# EAGLE schematic Breadboard Breakout Module (EAGLE 6.3)
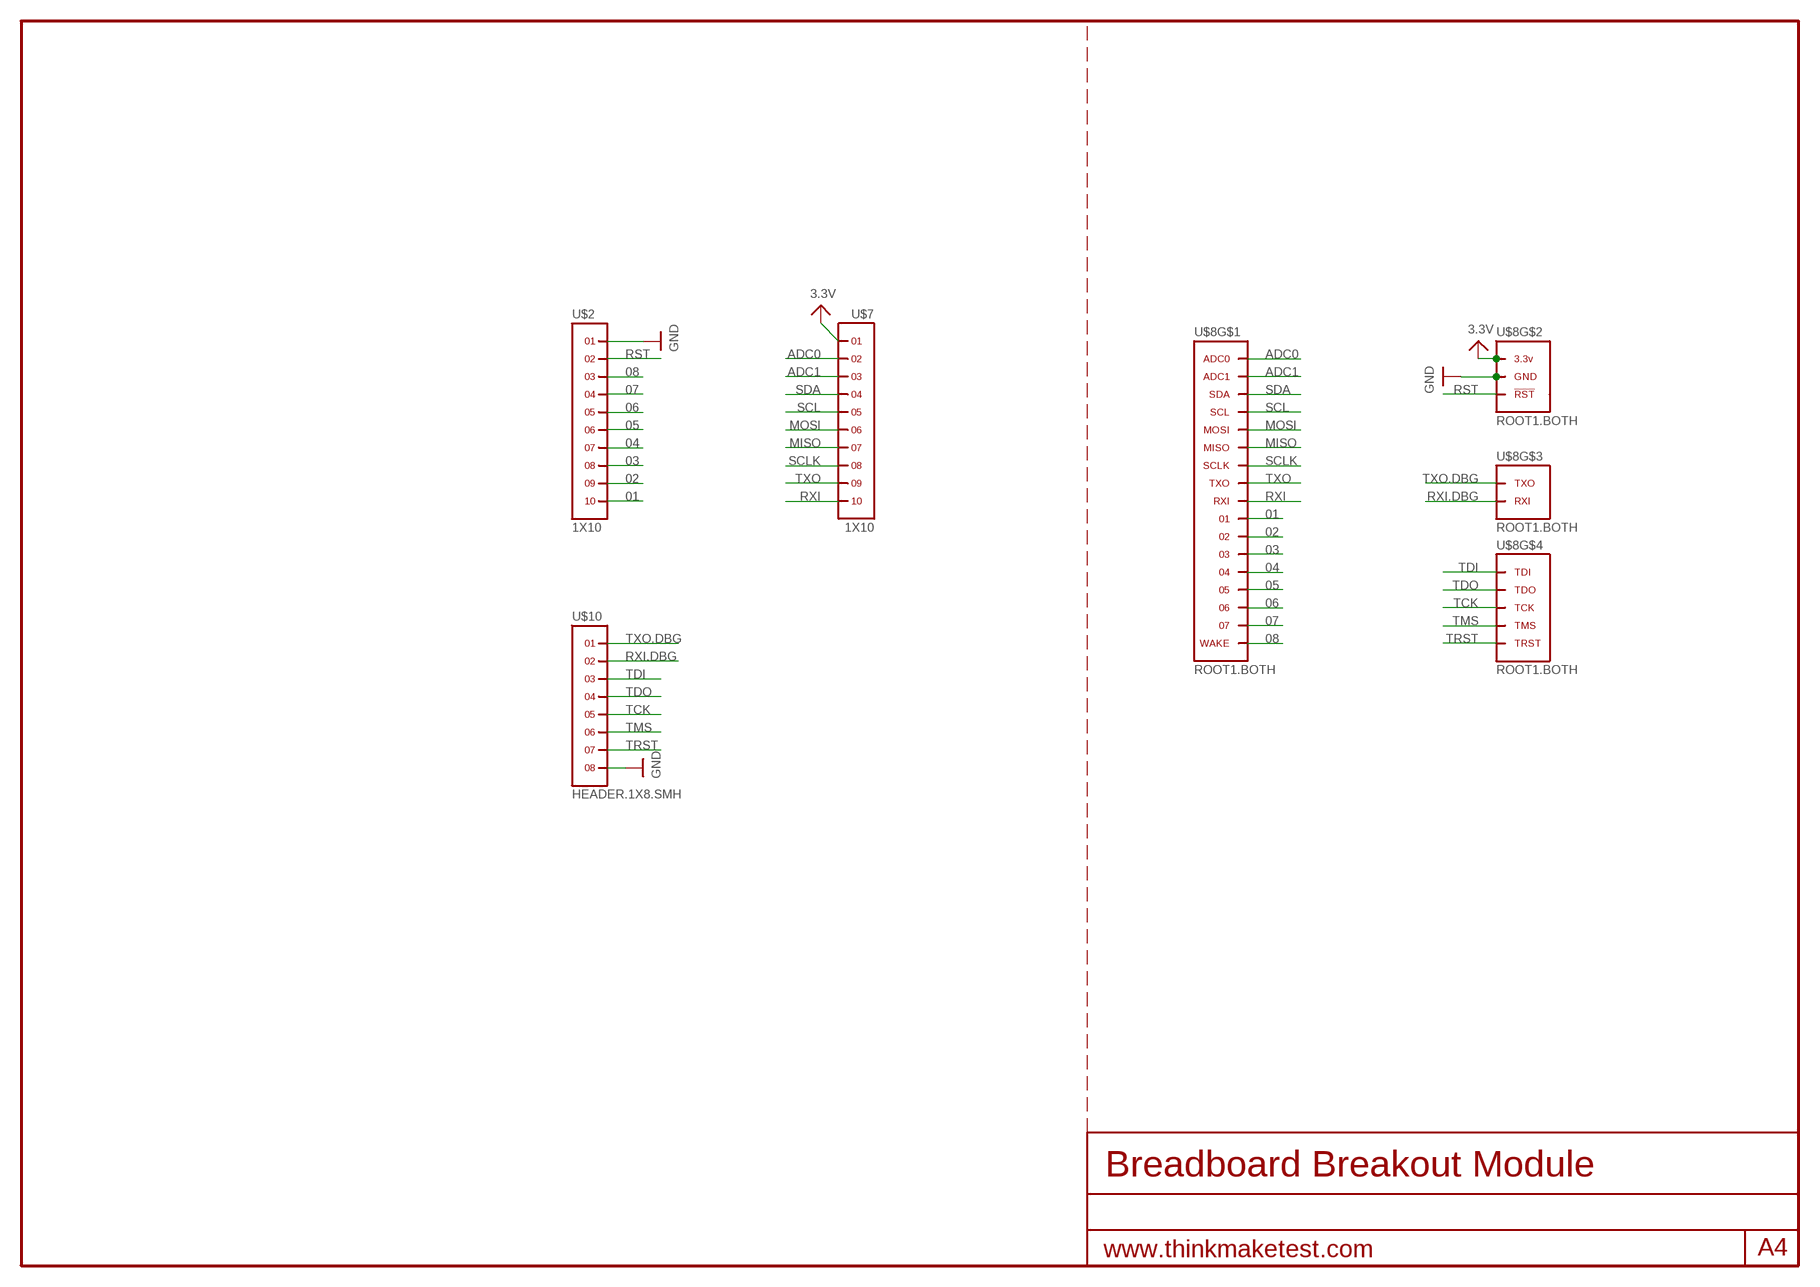
[diagram p0: schematic, sheet 1]

## Parts
U$2  1X10  [1X10]
U$7  1X10  [1X10]
U$8  ROOT1.BOTH  [ROOT1.BOTH]
U$10  HEADER.1X8.SMH  [SMH-108-XX-X-S]

## Nets
01: U$2.10 U$8.01 U$8.01@1 U$8.01@VIA
02: U$2.9 U$8.02 U$8.02@1 U$8.02@VIA
03: U$2.8 U$8.03 U$8.03@1 U$8.03@VIA
3.3V: U$7.1 U$8.3.3V@1(3.3V) U$8.3.3V@2(3.3V) U$8.3.3V@3(3.3V) U$8.3.3V@4(3.3V) U$8.3.3V@5(3.3V) U$8.3.3V@6(3.3V) U$8.3.3V@7(3.3V) U$8.3.3V@8(3.3V) U$8.3.3V@9(3.3V) U$8.3.3V@10(3.3V) U$8.3.3V@11(3.3V) U$8.3.3V@12(3.3V) U$8.3.3V@13(3.3V) U$8.3.3V@14(3.3V) U$8.3.3V@15(3.3V) U$8.3.3V@16(3.3V) U$8.3.3V@17(3.3V) U$8.3.3V@18(3.3V) U$8.3.3V@19(3.3V) U$8.3.3V@20(3.3V) U$8.3.3V@21(3.3V) U$8.3.3V@22(3.3V) U$8.3.3V@23(3.3V) U$8.3.3V@24(3.3V) U$8.3.3V@VIA(3.3V)
04: U$2.7 U$8.04 U$8.04@1 U$8.04@VIA
05: U$2.6 U$8.05 U$8.05@1 U$8.05@VIA
06: U$2.5 U$8.06 U$8.06@1 U$8.06@VIA
07: U$2.4 U$8.07 U$8.07@1 U$8.07@VIA
08: U$2.3 U$8.WAKE U$8.WAKE@1(WAKE) U$8.WAKE@VIA(WAKE)
ADC0: U$7.2 U$8.ADC0 U$8.ADC0@1(ADC0) U$8.ADC0@VIA(ADC0)
ADC1: U$7.3 U$8.ADC1 U$8.ADC1@1(ADC1) U$8.ADC1@VIA(ADC1)
GND: U$2.1 U$8.GND@1(GND) U$8.GND@2(GND) U$8.GND@3(GND) U$8.GND@4(GND) U$8.GND@5(GND) U$8.GND@6(GND) U$8.GND@7(GND) U$8.GND@8(GND) U$8.GND@9(GND) U$8.GND@10(GND) U$8.GND@11(GND) U$8.GND@12(GND) U$8.GND@13(GND) U$8.GND@14(GND) U$8.GND@15(GND) U$8.GND@16(GND) U$8.GND@17(GND) U$8.GND@18(GND) U$8.GND@19(GND) U$8.GND@20(GND) U$8.GND@21(GND) U$8.GND@22(GND) U$8.GND@23(GND) U$8.GND@24(GND) U$8.GND@25(GND) U$8.GND@26(GND) U$8.GND@VIA(GND) U$10.8
MISO: U$7.7 U$8.MISO U$8.MISO@1(MISO) U$8.MISO@VIA(MISO)
MOSI: U$7.6 U$8.MOSI U$8.MOSI@1(MOSI) U$8.MOSI@VIA(MOSI)
RST: U$2.2 U$8.RST(!RST) U$8.RST@1(!RST) U$8.RST@VIA(!RST)
RXI: U$7.10 U$8.RXI U$8.RXI@1(RXI) U$8.RXI@VIA(RXI)
RXI.DBG: U$8.RXI.DBG(RXI) U$8.RXI.DBG@1(RXI) U$8.RXI.DBG@VIA(RXI) U$10.2
SCL: U$7.5 U$8.SCL U$8.SCL@1(SCL) U$8.SCL@VIA(SCL)
SCLK: U$7.8 U$8.SCLK U$8.SCLK@1(SCLK) U$8.SCLK@VIA(SCLK)
SDA: U$7.4 U$8.SDA U$8.SDA@1(SDA) U$8.SDA@VIA(SDA)
TCK: U$8.TCK U$8.TCK@1(TCK) U$8.TCK@VIA(TCK) U$10.5
TDI: U$8.TDI U$8.TDI@1(TDI) U$8.TDI@VIA(TDI) U$10.3
TDO: U$8.TDO U$8.TDO@1(TDO) U$8.TDO@VIA(TDO) U$10.4
TMS: U$8.TMS U$8.TMS@1(TMS) U$8.TMS@VIA(TMS) U$10.6
TRST: U$8.TRST U$8.TRST@1(TRST) U$8.TRST@VIA(TRST) U$10.7
TXO: U$7.9 U$8.TXO U$8.TXO@1(TXO) U$8.TXO@VIA(TXO)
TXO.DBG: U$8.TXO.DBG(TXO) U$8.TXO.DBG@1(TXO) U$8.TXO.DBG@VIA(TXO) U$10.1

## Library data of the parts
U$2 U$7 = .headers(.1in):1X10
U$8 = thinkmaketest:ROOT1
U$10 = samtec:HEADER.1X8